# Altium schematic sheet schematic-50m-esp.schdoc
size 285 x 183 mm
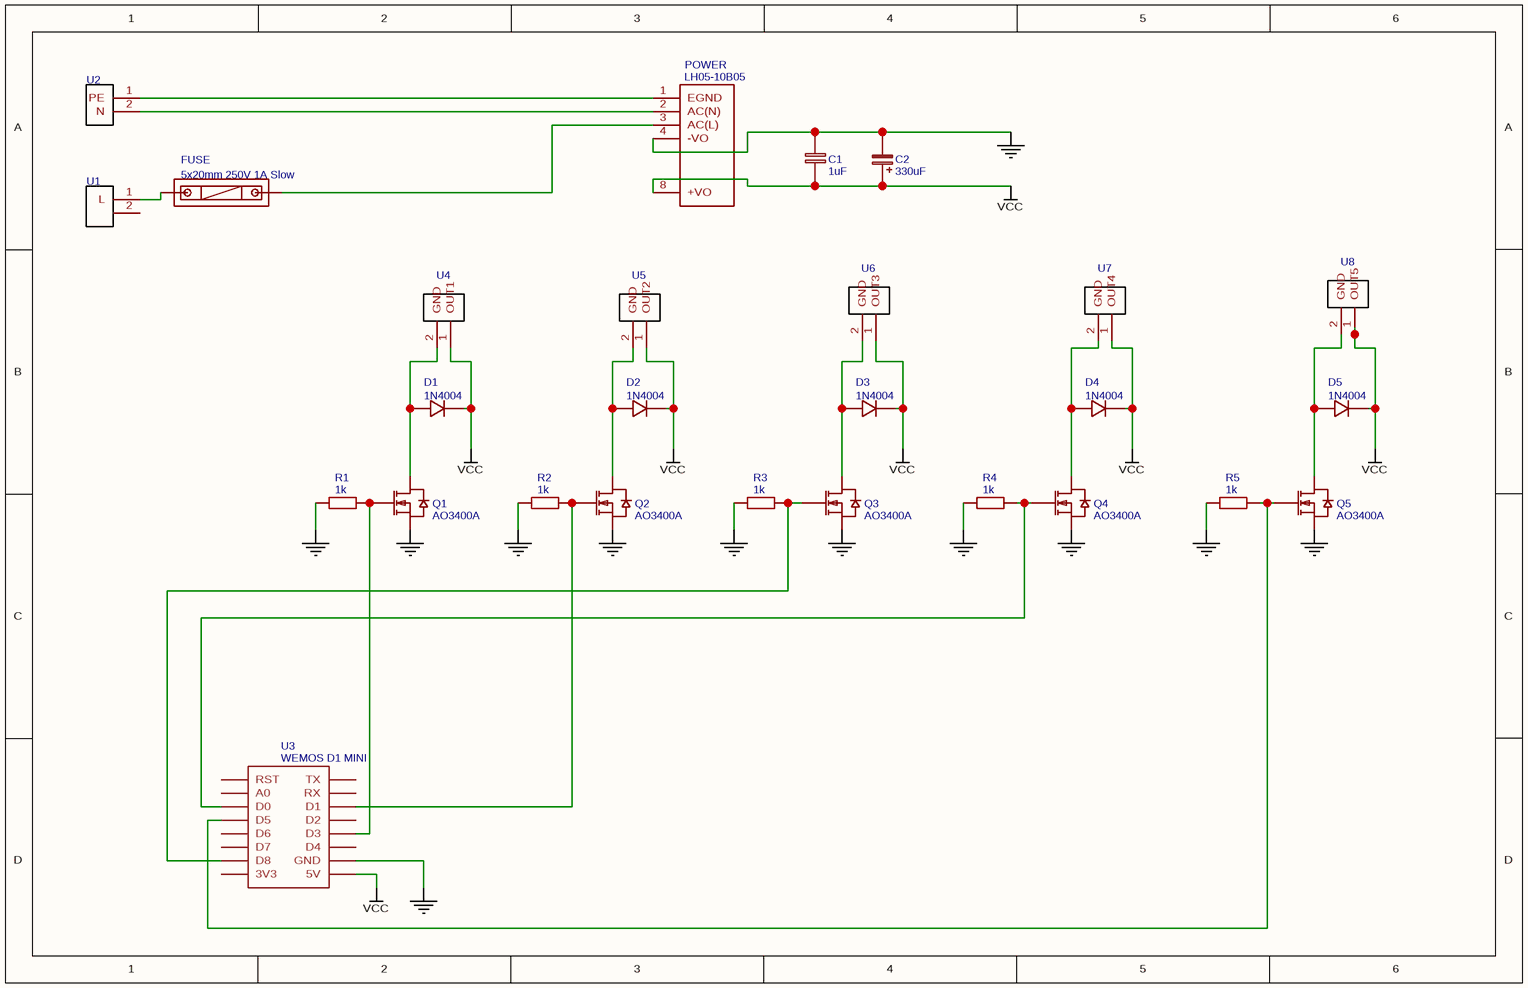
[diagram p0: schematic-50m-esp.schdoc]

## Parts
C1  1uF  [RAD-0.1]
C2  330uF  [CAP-D5.0XF2.0]
D1  1N4004  [DO-41]
D2  1N4004  [DO-41]
D3  1N4004  [DO-41]
D4  1N4004  [DO-41]
D5  1N4004  [DO-41]
FUSE  5x20mm 250V 1A Slow  [5MM*20MM]
POWER  LH05-10B05  [LH05-10B05]
Q1  AO3400A  [SOT-23(SOT-23-3)]
Q2  AO3400A  [SOT-23(SOT-23-3)]
Q3  AO3400A  [SOT-23(SOT-23-3)]
Q4  AO3400A  [SOT-23(SOT-23-3)]
Q5  AO3400A  [SOT-23(SOT-23-3)]
R1  1k  [AXIAL-0.4]
R2  1k  [AXIAL-0.4]
R3  1k  [AXIAL-0.4]
R4  1k  [AXIAL-0.4]
R5  1k  [AXIAL-0.4]
U1  1x2 5mm Screw Terminals  [1X2 5MM SCREW TERMINALS]  (value not drawn)
U2  1x2 5mm Screw Terminals  [1X2 5MM SCREW TERMINALS]  (value not drawn)
U3  WEMOS D1 MINI  [WEMOS D1 MINI]
U4  1x2 5mm Screw Terminals  [1X2 5MM SCREW TERMINALS]  (value not drawn)
U5  1x2 5mm Screw Terminals  [1X2 5MM SCREW TERMINALS]  (value not drawn)
U6  1x2 5mm Screw Terminals  [1X2 5MM SCREW TERMINALS]  (value not drawn)
U7  1x2 5mm Screw Terminals  [1X2 5MM SCREW TERMINALS]  (value not drawn)
U8  1x2 5mm Screw Terminals  [1X2 5MM SCREW TERMINALS]  (value not drawn)

## Nets
GND: C1.1 C2.2 POWER.4(-VO) Q1.2(S) Q2.2(S) Q3.2(S) Q4.2(S) Q5.2(S) R1.1 R2.1 R3.1 R4.1 R5.1 U3.GND
VCC: C1.2 C2.1 D1.2(K) D2.2(K) D3.2(K) D4.2(K) D5.2(K) POWER.8(+VO) U3.5V U4.1(OUT1) U5.1(OUT2) U6.1(OUT3) U7.1(OUT4) U8.1(OUT5)
NetD1_1: D1.1(A) Q1.3(D) U4.2(GND)
NetD2_1: D2.1(A) Q2.3(D) U5.2(GND)
NetD3_1: D3.1(A) Q3.3(D) U6.2(GND)
NetD4_1: D4.1(A) Q4.3(D) U7.2(GND)
NetD5_1: D5.1(A) Q5.3(D) U8.2(GND)
NetFUSE_1: FUSE.1 U1.1(L)
NetFUSE_2: FUSE.2 POWER.3(AC(L))
NetPOWER_1: POWER.1(EGND) U2.1(PE)
NetPOWER_2: POWER.2(AC(N)) U2.2(N)
NetQ1_1: Q1.1(G) R1.2 U3.D3
NetQ2_1: Q2.1(G) R2.2 U3.D1
NetQ3_1: Q3.1(G) R3.2 U3.D8
NetQ4_1: Q4.1(G) R4.2 U3.D0
NetQ5_1: Q5.1(G) R5.2 U3.D5

Not connected (* = marked no-connect by the designer): U1 2(N); U3 3V3 A0 D2 D4 D6 D7 RST RX TX

## Library data of the parts
C1 = 1uF: nameAlias: Value(F); BOM_Manufacturer Part: ?; spicePre: C; spiceSymbolName: Cap_RAD-0.1_EU
C2 = 330uF: nameAlias: Value(F); Contributor: EasyEDA; BOM_Manufacturer Part: ?; spicePre: C; spiceSymbolName: Cap_Electrolytic(TH)_D5.0XF2.0_EU
D1-D5 = 1N4004: BOM_Manufacturer: MDD; Contributor: LCSC; BOM_Supplier: LCSC; BOM_Manufacturer Part: 1N4004; image: //image.lceda.cn/szlcsc/C3058.jpg; spicePre: D; BOM_Supplier Part: C3058
FUSE = 5x20mm 250V 1A Slow: BOM_Manufacturer Part: Fuse transparent seat; BOM_Manufacturer: ReliaPro; BOM_Supplier: LCSC; image: //image.lceda.cn/szlcsc/C58066.jpg; spicePre: F; BOM_Supplier Part: C58066
POWER = LH05-10B05: BOM_Manufacturer: MORNSUN; BOM_Supplier: LCSC; BOM_Manufacturer Part: LH05-10B05; spicePre: U; BOM_Supplier Part: C91816
Q1-Q5 = AO3400A: BOM_Manufacturer: AOS; Contributor: LCSC; BOM_Supplier: LCSC; BOM_Manufacturer Part: AO3400A; BOM_LCSC Assembly: Yes; image: //image.lceda.cn/szlcsc/C20917.jpg; spicePre: Q; BOM_Supplier Part: C20917
R1-R5 = 1k: nameAlias: Value(Ω); BOM_Manufacturer Part: ?; spicePre: R; spiceSymbolName: Res_AXIAL-0.4(1/4W)_EU
U1 U2 U4-U8 = 1x2 5mm Screw Terminals: Contributor: IDVert3X; BOM_Manufacturer Part: 1x2 5mm Screw Terminals; spicePre: U
U3 = WEMOS D1 MINI: sourceId: YemgaslDx; timeStamp: 1474924859; BOM_Manufacturer Part: ?; spicePre: U